# EAGLE design ECPR_EMITTER (EAGLE 9.4.2)
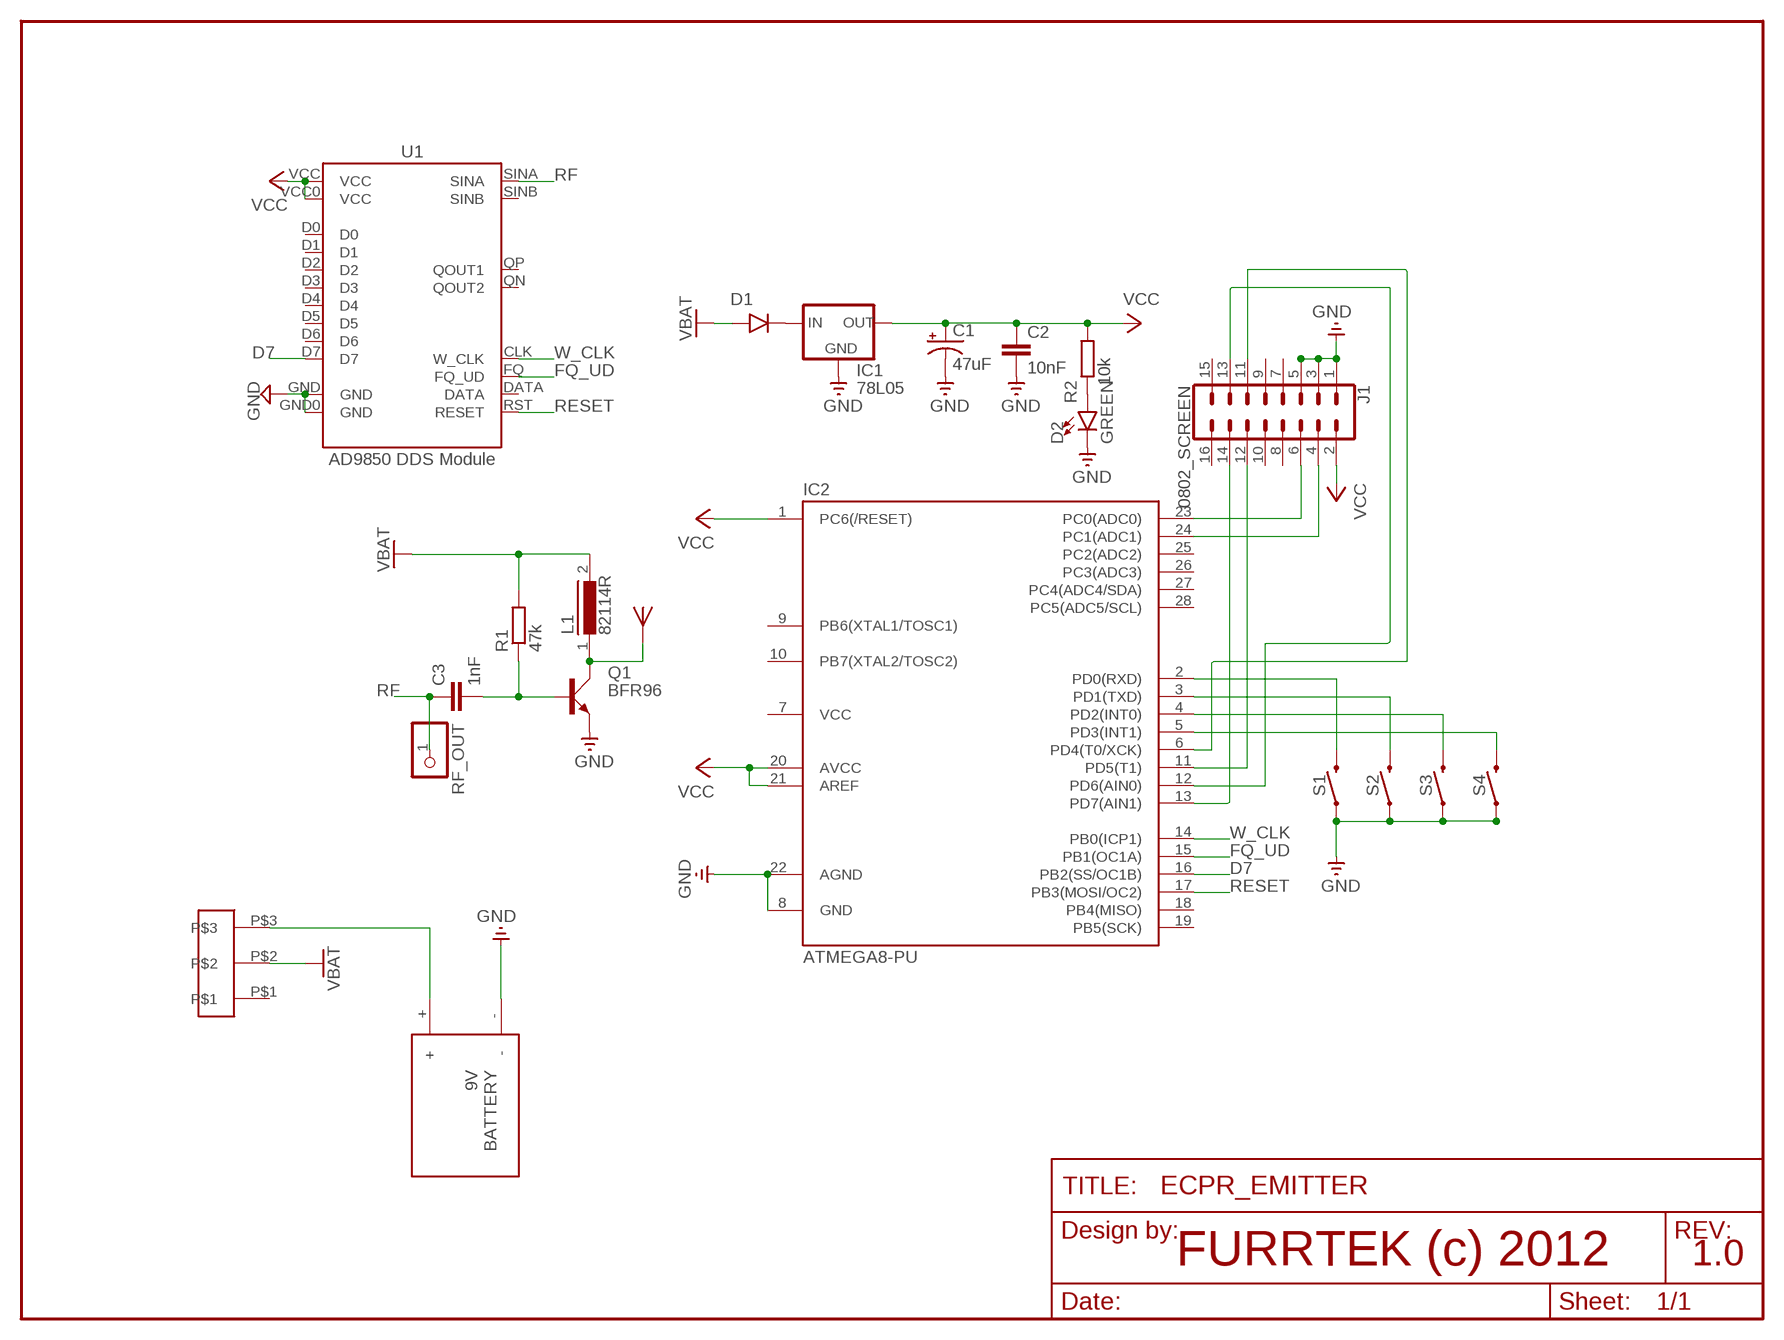
[diagram p0: schematic, sheet 1]

## Parts
C1  47uF  CAP_POLPTH2  [CPOL-RADIAL-10UF-25V]
C2  10nF  10NF-PTH-10MM-10000V-1-%  [CAP-PTH-10MM]
C3  1nF  C5/3  [C5B3]
D1  1N4001  [DO41-10]
D2  GREEN  LED-3MM-NO_SILK  [LED_3MM-NS]
FRAME1  FRAME-LETTERNO_PACKAGE  [DUMMY]
IC1  78L05  V_REG_78XXSIDE  [78XXL]
IC2  ATMEGA8-PU  [DIL28-3]
J1  0802_SCREEN  CONN_08X2  [2X8]
L1  82114R  [82114R]
Q1  BFR96  [SOT37]
R1  47k  R-EU_0207/7  [0207/7]
R2  10k  R-EU_0207/7  [0207/7]
RF_OUT  PINHD-1X1  [1X01]
S1  MOMENTARY-SWITCH-SPST-PTH-12MM  [TACTILE_SWITCH_PTH_12MM]
S2  MOMENTARY-SWITCH-SPST-PTH-12MM  [TACTILE_SWITCH_PTH_12MM]
S3  MOMENTARY-SWITCH-SPST-PTH-12MM  [TACTILE_SWITCH_PTH_12MM]
S4  MOMENTARY-SWITCH-SPST-PTH-12MM  [TACTILE_SWITCH_PTH_12MM]
U1  AD9850 DDS Module  DDS_MODULE:AD9850DDS_MODULE  [DDS_AD9850]
U$1  ANT.  ANTENNA  [ANTENNA]
U$2  PACKAGESWITCH  [SLIDESWITCH]
U$3  BAT  [BAT]

## Nets
D7: IC2.16(PB2(SS/OC1B)) U1.D7
FQ_UD: IC2.15(PB1(OC1A)) U1.FQ(FQ_UD)
GND: C1.2(-) C2.2 D2.K(C) IC1.GND IC2.8(GND) IC2.22(AGND) J1.1 J1.3 J1.5 Q1.2(E) S1.1 S2.1 S3.1 S4.1 U1.GND U1.GND0(GND) U$3.-
N$1: D1.C(CATHODE) IC1.IN
N$2: C3.2 Q1.3(B) R1.1
N$3: IC2.2(PD0(RXD)) S1.3
N$4: IC2.3(PD1(TXD)) S2.3
N$5: IC2.4(PD2(INT0)) S3.3
N$6: IC2.5(PD3(INT1)) S4.3
N$7: L1.1 Q1.1(C) U$1.ANT
N$8: IC2.24(PC1(ADC1)) J1.4
N$9: IC2.23(PC0(ADC0)) J1.6
N$10: IC2.13(PD7(AIN1)) J1.14
N$11: IC2.11(PD5(T1)) J1.12
N$12: U$2.P$3 U$3.+
N$13: IC2.12(PD6(AIN0)) J1.13
N$14: IC2.6(PD4(T0/XCK)) J1.11
N$16: D2.A R2.1
RESET: IC2.17(PB3(MOSI/OC2)) U1.RST(RESET)
RF: C3.1 RF_OUT.1 U1.SINA
VBAT: D1.A(ANODE) L1.2 R1.2 U$2.P$2
VCC: C1.1(+) C2.1 IC1.OUT IC2.1(PC6(/RESET)) IC2.20(AVCC) IC2.21(AREF) J1.2 R2.2 U1.VCC U1.VCC0(VCC)
W_CLK: IC2.14(PB0(ICP1)) U1.CLK(W_CLK)
Unconnected: IC2.9(PB6(XTAL1/TOSC1)) IC2.10(PB7(XTAL2/TOSC2)) IC2.18(PB4(MISO)) IC2.19(PB5(SCK)) IC2.25(PC2(ADC2)) IC2.26(PC3(ADC3)) IC2.27(PC4(ADC4/SDA)) IC2.28(PC5(ADC5/SCL)) J1.7 J1.8 J1.9 J1.10 J1.15 J1.16 U1.D0 U1.D1 U1.D2 U1.D3 U1.D4 U1.D5 U1.D6 U1.DATA U1.QN(QOUT2) U1.QP(QOUT1) U1.SINB U$2.P$1

## Notes on the sheet
- FURRTEK (c) 2012 | 1.0

## Power pins joined to a net without a drawn wire
VCC: IC2.7(VCC)

## Library data of the parts
C1 = SparkFun:CAP_POL: Capacitor Polarized These are standard SMD and PTH capacitors. Normally 10uF, 47uF, and 100uF in electrolytic and tantalum varieties. Always verify the external diameter of the through hole cap, it varies with capacity, voltage, and manufacturer. The EIA devices should be standard.
C2 = SparkFun-Capacitors:10NF: 0.01uF/10nF/10,000pF ceramic capacitors A capacitor is a passive two-terminal electrical component used to store electrical energy temporarily in an electric field. CAP-09321; PROD_ID: CAP-09321
C3 = capacitor-wima:C: CAPACITOR naming: grid - package width
D1 = tango:1N4001: DIODE general purpose rectifier, 1 A
D2 = SparkFun-LED:LED: LED (Generic) Standard schematic elements and footprints for 5mm, 3mm, 1206, and 0603 sized LEDs. Generic LEDs with no color specified.
FRAME1 = SparkFun-Aesthetics:FRAME-LETTER: Schematic Frame - Letter Standard 8.5x11 US Letter frame; DESIGNER: Nobody; VERSION: v01
IC1 = SparkFun:V_REG_78XX: Voltage Regulator Standard 7805 5V regulator. IGO (Input Ground Output). Spark Fun Electronics SKU : COM-00107
IC2 = atmega8:ATMEGA8-PU
J1 = SparkFun-Connectors:CONN_08X2: Multi connection point. Often used as Generic Header-pin footprint for 0.1 inch spaced/style header connections You can populate with any combo of single row headers, but if you'd like an exact match, check this: Header - 2x8 (Male, 0.1") <https://www.sparkfun.com/products/13156> (PRT-13156) On any of the 0.1 inch spaced packages, you can populate with these: Break Away Headers - Straight <https://www.sparkfun.com/products/116> (PRT-00116) Break Away Male Headers - Right Angle <https://www.sparkfun.com/products/553> (PRT-00553) Female Headers <https://www.sparkfun.com/products/115> (PRT-00115) Break Away Headers - Machine Pin <https://www.sparkfun.com/products/117> (PRT-00117) Break Away Female Headers - Swiss Machine Pin <https://www.sparkfun.com/products/743> (PRT-00743)
L1 = inductors:82114R: INDUCTOR
Q1 = transistor-small-signal:BFR96: NPN Silicon High-Frequency Transistor Source: http://www.ee.siue.edu/~alozows/library/datasheets/BFR96.pdf
R1 R2 = resistor:R-EU_: RESISTOR, European symbol
RF_OUT = adafruit:PINHD-1X1: Pin header 1x1 for 0.1" spacing With round pins
S1-S4 = SparkFun-Switches:MOMENTARY-SWITCH-SPST: Momentary Switch (Pushbutton) - SPST Normally-open (NO) SPST momentary switches (buttons, pushbuttons). Variants PTH-12MM - 12mm square, through-hole Momentary Pushbutton Switch - 12mm Square <https://www.sparkfun.com/products/9190> (COM-09190) PTH-6.0MM, PTH-6.0MM-KIT - 6.0mm square, through-hole Mini Pushbutton Switch <https://www.sparkfun.com/products/97> (COM-00097) KIT package intended for soldering kit's - only one side of pads' copper is exposed. PTH-RIGHT-ANGLE-KIT - Right-angle, through-hole Right Angle Tactile Button <https://www.sparkfun.com/products/10791> - Used on SparkFun BigTime Watch Kit <https://www.sparkfun.com/products/11734> SMD-12MM - 12mm square, surface-mount Tactile Button - SMD (12mm) <https://www.sparkfun.com/products/12993> (COM-12993) Used on SparkFun PicoBoard <https://www.sparkfun.com/products/11888> SMD-4.5MM - 4.5mm Square Trackball Switch Used on SparkFun Blackberry Trackballer Breakout <https://www.sparkfun.com/products/13169> SMD-4.6MMX2.8MM - 4.60mm x 2.80mm, surface mount Used on SparkFun SAMD21 Mini Breakout <https://www.sparkfun.com/products/13664> SMD-5.2MM, SMD-5.2-REDUNDANT - 5.2mm square, surface-mount Mini Pushbutton Switch - SMD <https://www.sparkfun.com/products/8720> (COM-08720) Used on Arduino Pro Mini <https://www.sparkfun.com/products/11114> REDUNDANT package connects both switch circuits together SMD-6.0X3.5MM - 6.0 x 3.5mm, surface mount Momentary Reset Switch SMD <https://www.sparkfun.com/products/8229> (COM-08229) SMD-6.2MM-TALL - 6.2mm square, surface mount Tactile Button - SMD (6mm) <https://www.sparkfun.com/products/12992> Used on SparkFun Digital Sandbox <https://www.sparkfun.com/products/12651> SMD-RIGHT-ANGLE - Right-angle, surface mount Used on SparkFun Block for Intel® Edison - Arduino <https://www.sparkfun.com/products/13036>; PROD_ID: SWCH-09185; SF_SKU: COM-09190
U1 = dds-module-ad9850:DDS_MODULE:AD9850: AD9850 DDS Module Created by Johan Adler, October 2014. Not tested on an actual PCB, so I can't promise anything. Also please check the actual pinout of your specific module. Mine are of the low price eBay version, and the pinout is correct for my modules. The placement of VCC over data pins over GND on the symbol is meant to make it easier to set it up for default serial transfer. For this you would connect D0 and D1 to VCC, D2 to GND. IOUT is analog signal out, sinus wave, QOUT is square wave. Outputs 1 are normal, outputs 2 are inverted.
U$1 = computronics.com.au:ANTENNA: Antenna - single wire
U$2 = SLIDESWITCH:PACKAGESWITCH
U$3 = BATTERY:BAT: 2000mAh battery

## Board
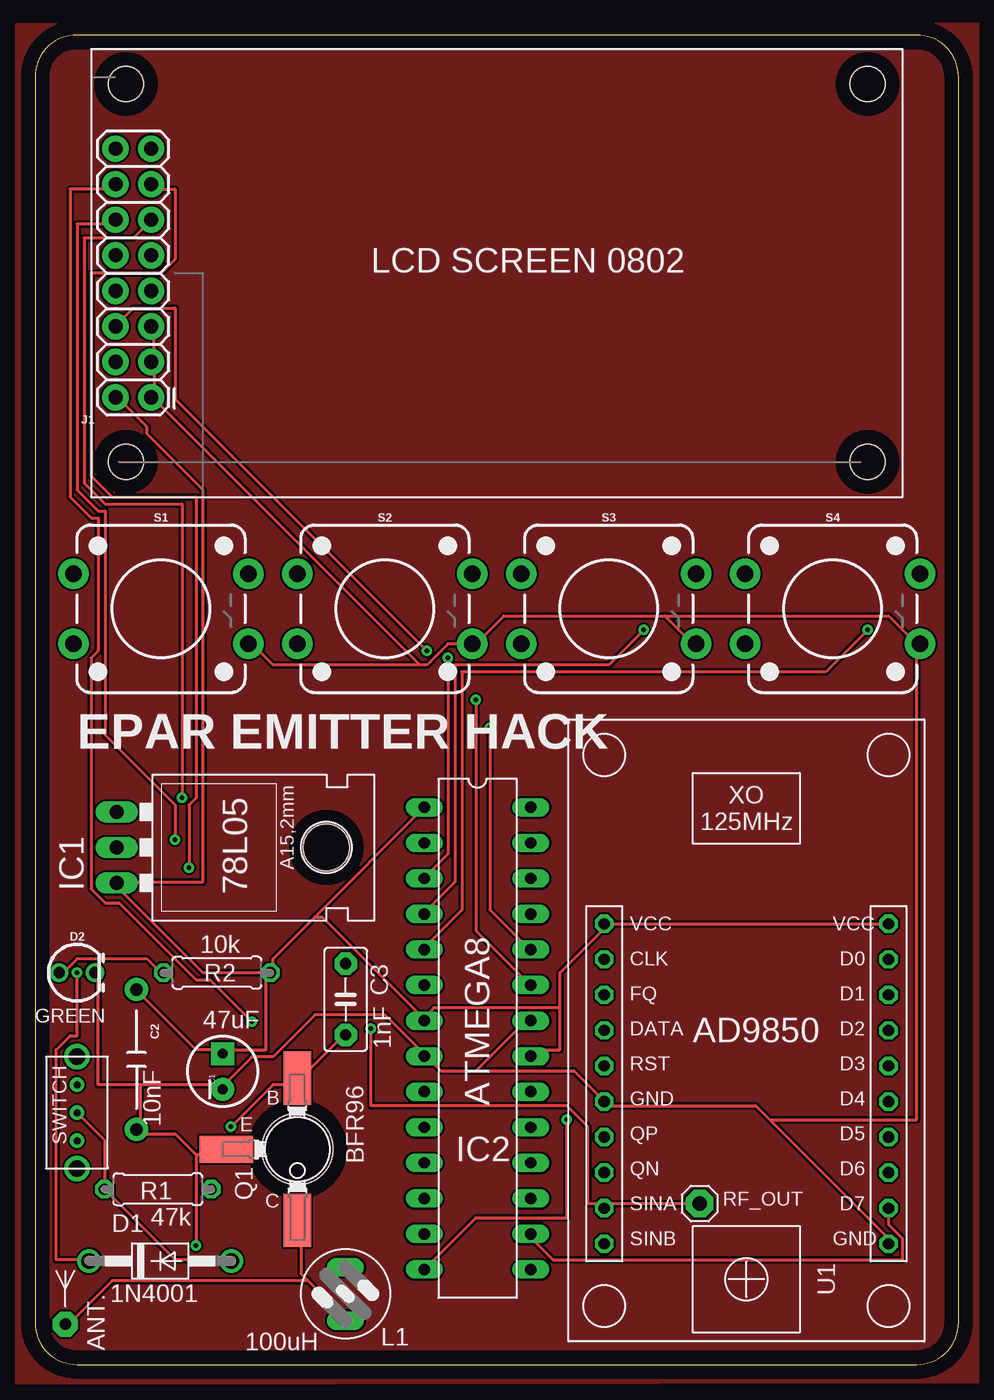
[diagram p1: board, top side]
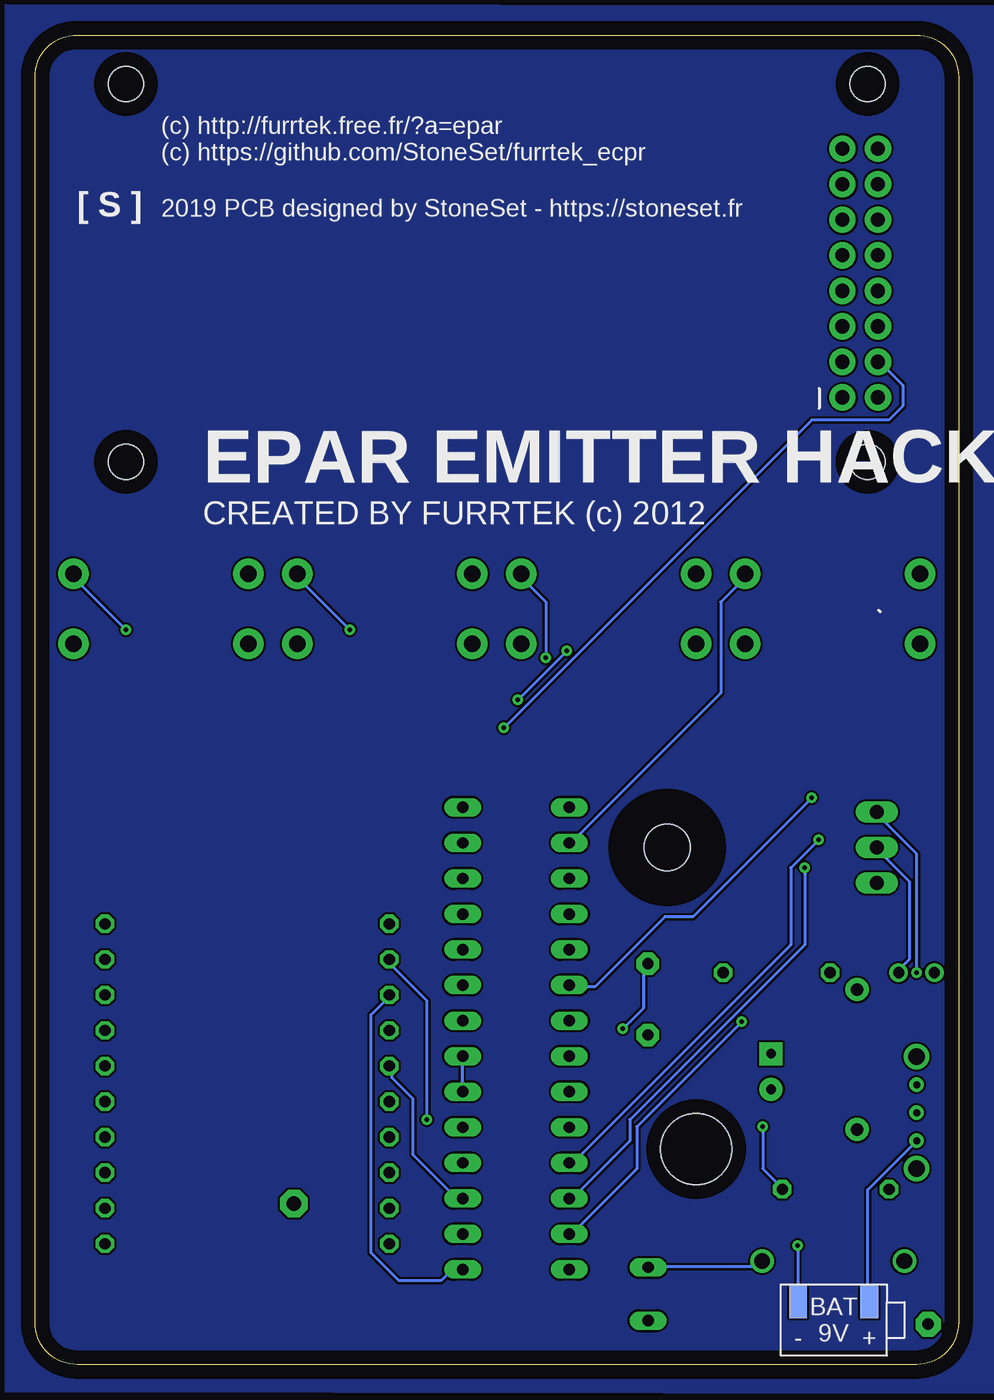
[diagram p2: board, bottom side, seen from below]

Size 66 x 95 mm. Coordinates in mm from the lower left corner, seen from the top.
Outline: 0,92 0,3 arc90 3,0 63,0 arc90 66,3 66,92 arc90 63,95 3,95 arc90 0,92
Copper layers (1*16): Top 0.035mm / dielectric 1.5mm / Bottom 0.035mm
Design rules "default *": minimum track width 9mil, minimum drill 0.35mm, track to track 6mil, track to pad 6mil, pad to pad 6mil, via to via 6mil, smd to smd 6mil, copper to edge 40mil, drill to drill 6mil, minimum pad ring 10mil, minimum via ring 8mil, stop-mask expansion 4mil, vias tented up to drill 0mil, thermal gap 10mil
Holes 2.5 mm at 59.5,91.5 59.5,64.5 6.5,64.5 6.5,91.5

### Footprints (pad centres in the part's own frame; a part is rotated, then mirrored left to right if it is on the bottom)
CPOL-RADIAL-10UF-25V = drill 0.7 pad 1.651 square: 1 1.27,0 | drill 0.7 pad 1.651: 2 -1.27,0
CAP-PTH-10MM = drill 0.9 pad 1.651: 1 -5,0; 2 5,0
C5B3 = drill 0.813 pad 1.6 octagon: 1 -2.54,0; 2 2.54,0
DO41-10 = drill 1.118: A 5.08,0; C -5.08,0
LED_3MM-NS = drill 0.813: A -1.27,0; K 1.27,0
78XXL = drill 1.016 long: GND 0,-3.81; IN -2.54,-3.81; OUT 2.54,-3.81 | hole 3.302: 0,11.176
DIL28-3 = drill 0.813 long: 1 -16.51,-3.81; 2 -13.97,-3.81; 3 -11.43,-3.81; 4 -8.89,-3.81; 5 -6.35,-3.81; 6 -3.81,-3.81; 7 -1.27,-3.81; 8 1.27,-3.81; 9 3.81,-3.81; 10 6.35,-3.81; 11 8.89,-3.81; 12 11.43,-3.81; 13 13.97,-3.81; 14 16.51,-3.81; 15 16.51,3.81; 16 13.97,3.81; 17 11.43,3.81; 18 8.89,3.81; 19 6.35,3.81; 20 3.81,3.81; 21 1.27,3.81; 22 -1.27,3.81; 23 -3.81,3.81; 24 -6.35,3.81; 25 -8.89,3.81; 26 -11.43,3.81; 27 -13.97,3.81; 28 -16.51,3.81
2X8 = drill 1.016 pad 1.88: 1 0,0; 2 0,2.54; 3 2.54,0; 4 2.54,2.54; 5 5.08,0; 6 5.08,2.54; 7 7.62,0; 8 7.62,2.54; 9 10.16,0; 10 10.16,2.54; 11 12.7,0; 12 12.7,2.54; 13 15.24,0; 14 15.24,2.54; 15 17.78,0; 16 17.78,2.54
82114R = drill 0.813 long: 1 0,1.905; 2 0,-1.905
SOT37 = smd 1.93 x 3.81: 1 0,5.08; 3 0,-5.08 | smd 3.81 x 1.93: 2 5.08,0 | hole 5.08: 0,0
0207/7 = drill 0.813 octagon: 1 -3.81,0; 2 3.81,0
1X01 = drill 1.016 pad 1.93 octagon: 1 0,0
TACTILE_SWITCH_PTH_12MM = drill 1.2 pad 2.159: 1 6.25,-2.5; 2 -6.25,-2.5; 3 6.25,2.5; 4 -6.25,2.5
DDS_AD9850 = drill 0.8 octagon: CLK 5.08,10.16; D0 5.08,-10.16; D1 2.54,-10.16; D2 0,-10.16; D3 -2.54,-10.16; D4 -5.08,-10.16; D5 -7.62,-10.16; D6 -10.16,-10.16; D7 -12.7,-10.16; DATA 0,10.16; FQ 2.54,10.16; GND -5.08,10.16; GND0 -15.24,-10.16; QN -10.16,10.16; QP -7.62,10.16; RST -2.54,10.16; SINA -12.7,10.16; SINB -15.24,10.16; VCC 7.62,10.16; VCC0 7.62,-10.16
ANTENNA = drill 0.813 pad 1.778 octagon: ANT 0,0
SLIDESWITCH = drill 0.5: P$1 0,0; P$2 0,-2; P$3 0,-4 | drill 1.2: P$4 0,2; P$5 0,-6
BAT = smd 1.27 x 2.337: + 7.62,-2.54; - 2.54,-2.54

### Placement (x,y rotation side)
C1  13.4,20.94 90 top
C2  7.25,21.79 270 top
C3  22.2,26.09 270 top
D1  8.95,7.4 0 top
D2  3,28 0 top
FRAME1  0,0 0 top
IC1  9.65,36.95 270 top
IC2  31.62,23.3 270 top
J1  8.3,69.1 90 top
L1  22.18,5.04 180 top
Q1  18.75,15.38 180 top
R1  8.78,12.52 180 top
R2  13,28 0 top
RF_OUT  47.5,11.5 0 top
S1  9,54 0 top
S2  25,54 0 top
S3  41,54 0 top
S4  57,54 0 top
U1  50.84,23.87 90 top
U$1  2.17,2.88 0 top
U$2  3,20 0 top
U$3  14,7 0 bottom

### Tracks (layer width: path | path; a pad name or v marks a point on that pad's centre or on a via)
BOT
  pour Bottom: -2.46,-2.05 68.1,-1.96 68.1,97.16 -2.46,97.07
D7
  Top 0.229: U1.D7 61,10 62,9 62,7.5 37,7.5 35.5,9 IC2.16
FQ_UD
  Bottom 0.229: U1.FQ 41,26 42,25 42,8 40,6 37,6 36.5,6.5 35.5,6.5 IC2.15
GND  (via drill 0.35)
  Top 0.229: J1.5 8.5,74 8.5,72 J1.3 8.5,71.5 8.5,69.5 J1.1 8.5,69 27.5,50 | 27.5,50 28,50 29.5,51.5 S2.1 31.5,51.5 33.5,53.5 45,53.5 | 27.5,50 17,50 15.5,51.5 S1.1 | 45,53.5 47,51.5 S3.1 | 63,51.5 61,53.5 45,53.5 | 11.5,15 v11.5,8.5 | 11.5,15 13.5,15 Q1.2 | 7.5,20 13,20 C1.2 13.5,20 15.5,22 17,22 20,25 25,25 27.5,22.5 IC2.8 28,22 29,21 31.5,21 | 7.5,20 4.5,20 4.5,28 D2.K | 7.5,20 7.5,17 C2.2 7.5,16.5 10,16.5 11.5,15 | 31.5,21 38.5,21 40.5,19 U1.GND 41,18.5 51.5,18.5 52.5,17.5 | 52.5,17.5 61,9 U1.GND0 | 31.5,21 35,24.5 IC2.22 | 63,51.5 63,17.5 52.5,17.5 | 63,51.5 S4.1
  Bottom 0.229: v11.5,8.5 11.5,4.5 U$3.- | IC1.GND 5.5,36.5 3.5,34.5 3.5,29 4.5,28 D2.K
N$1  (via drill 0.35)
  Top 0.229: v3,28 3,23.5 2.5,23.5 1.5,22.5 1.5,7.5 3.5,7.5 D1.C
  Bottom 0.229: v3,28 3,36.5 5.5,39 IC1.IN
N$2  (via drill 0.35)
  Top 0.229: v14,17 17,20 18.5,20 Q1.3 19,20.5 22,23.5 C3.2
  Bottom 0.229: v14,17 14,14 13,13 R1.1
N$3
  Bottom 0.229: IC2.2 27.5,37.5 17,48 17,54.5 15,56.5 S1.3
N$4  (via drill 0.35)
  Top 0.229: v29.5,50.5 29.5,36.5 28,35 IC2.3
  Bottom 0.229: v29.5,50.5 29.5,54.5 31.5,56.5 S2.3
N$5  (via drill 0.35)
  Top 0.229: v43.5,52.5 41,50 30,50 30,34.5 28,32.5 IC2.4
  Bottom 0.229: v43.5,52.5 47.5,56.5 S3.3
N$6  (via drill 0.35)
  Top 0.229: v59.5,52.5 56.5,49.5 30.5,49.5 30.5,32.5 28,30 IC2.5
  Bottom 0.229: v59.5,52.5 63.5,56.5 S4.3
N$7
  Top 0.229: 19.5,6 19,6.5 19,10 Q1.1 | 19.5,6 22,3.5 L1.1 | 19.5,6 5.5,6 2.5,3 U$1.ANT
N$8  (via drill 0.35)
  Top 0.229: v32.5,45.5 32.5,32.5 35,30 IC2.24
  Bottom 0.229: v32.5,45.5 10.5,67.5 5,67.5 4,68.5 4,70 5.5,71.5 J1.4
N$9  (via drill 0.35)
  Top 0.229: v31.5,47.5 31.5,31 35,27.5 IC2.23 | v28,51 10,69 10,75.5 7,75.5 6,74.5 J1.6
  Bottom 0.229: v28,51 v31.5,47.5
N$10  (via drill 0.35)
  Top 0.229: v15.5,24.5 12.5,27.5 11.5,27.5 6,33 5,33 4,34 4,50.5 4.5,51 4.5,60.5 4,60.5 2.5,62 2.5,84 5.5,84 J1.14
  Bottom 0.229: v15.5,24.5 23,17 23,14 27.5,9.5 IC2.13
N$11  (via drill 0.35)
  Top 0.229: v10,37.5 10,40 5,45 5,61 4.5,61 3,62.5 3,81.5 5.5,81.5 J1.12
  Bottom 0.229: v10,37.5 12,35.5 12,30 27.5,14.5 IC2.11
N$12
  Bottom 0.229: U$2.P$3 6.5,12.5 6.5,4.5 U$3.+
N$13  (via drill 0.35)
  Top 0.229: v11,35.5 11,40 11.5,40.5 11.5,62 5.5,62 4,63.5 4,78 9,78 10,79 10,84 8.5,84 J1.13
  Bottom 0.229: v11,35.5 11,30 23.5,17.5 23.5,16 27.5,12 IC2.12
N$14  (via drill 0.35)
  Top 0.229: v10.5,40.5 10.5,61.5 5,61.5 3.5,63 3.5,80.5 7,80.5 J1.11
  Bottom 0.229: v10.5,40.5 19,32 21,32 26,27 27.5,27 IC2.6
N$16
  Top 0.229: D2.A 2,28 3,29 8,29 9,28 R2.1
RESET
  Bottom 0.229: U1.RST 40.5,21 40.5,20.5 39,19 39,15 35.5,11.5 IC2.17
RF  (via drill 0.35)
  Top 0.229: RF_OUT.1 41,11.5 U1.SINA 40.5,11.5 39.5,11.5 39.5,17 38,18.5 24,18.5 v24,24
  Bottom 0.229: v24,24 22.5,25.5 22.5,28.5 C3.1
TOP
  pour Top: -1.36,-1.37 67.45,-1.28 67.45,95.85 -1.36,95.77
VBAT
  Top 0.229: U$2.P$2 5,16 5,13 R1.2 5,12.5 10,7.5 14,7.5 D1.A
  Bottom 0.229: L1.2 22,7 14.5,7 D1.A
VCC
  Top 0.229: 37.5,25.5 37.5,22.5 35.5,22.5 IC2.21 | 37.5,25.5 37.5,28 40.5,31 U1.VCC 41,31.5 U1.VCC0 | 37.5,25.5 28.5,25.5 28,25 IC2.7 27.5,25 20.5,32 20,32 | 16.5,28 16.5,22.5 13.5,22.5 C1.1 13,22.5 11.5,22.5 7.5,26.5 C2.1 | 20,32 17,29 17,28 R2.2 16.5,28 | 20,32 IC2.1 | 16.5,28 12,28 6,34 IC1.OUT 6,34.5 12,34.5 12,62.5 8,66.5 8,67 6,69 J1.2
  Bottom 0.229: IC2.20 35.5,19.5 35.5,22 IC2.21
W_CLK  (via drill 0.35)
  Top 0.229: v38,17.5 38,10.5 31.5,10.5 28,7 IC2.14
  Bottom 0.229: v38,17.5 38,26 40.5,28.5 U1.CLK

### Text on the board
tPlace: LCD SCREEN 0802 | EPAR EMITTER HACK | 78L05 | VCC | VCC | 10k | CLK | D0 | FQ | D1 | GREEN | 47uF | DATA | D2 | 1nF | AD9850 | RST | D3 | ATMEGA8 | GND | D4 | 10nF | SWITCH | QP | D5 | BFR96 | QN | D6 | SINA | D7 | 47k | SINB | GND | 1N4001 | ANT. | 100uH
bPlace: (c) http://furrtek.free.fr/?a=epar / (c) https://github.com/StoneSet/furrtek_ecpr | 2019 PCB designed by StoneSet - https://stoneset.fr | [ S ] | EPAR EMITTER HACK | CREATED BY FURRTEK (c) 2012